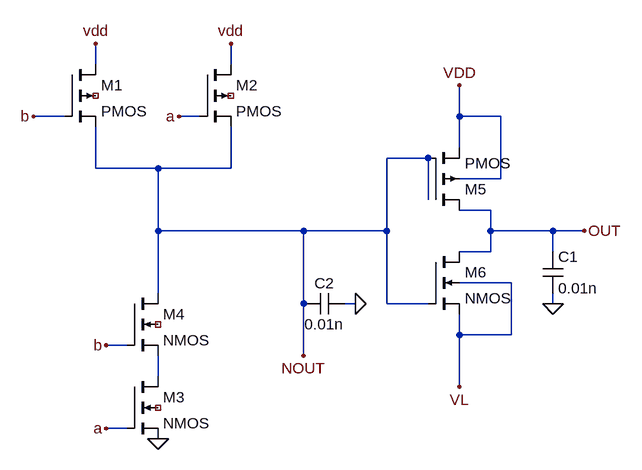
[diagram p0: schematic AND_GATE1.asc]
AND_GATE1.asc, the LTspice schematic file:
Version 4
SHEET 1 880 680
WIRE 16 -128 16 -160
WIRE 224 -128 224 -160
WIRE -32 -48 -80 -48
WIRE 176 -48 144 -48
WIRE 576 -48 576 -96
WIRE 640 -48 576 -48
WIRE 576 0 576 -48
WIRE 528 16 464 16
WIRE 16 32 16 -32
WIRE 112 32 16 32
WIRE 224 32 224 -32
WIRE 224 32 112 32
WIRE 640 48 640 -48
WIRE 640 48 576 48
WIRE 528 80 528 16
WIRE 624 96 576 96
WIRE 112 128 112 32
WIRE 336 128 112 128
WIRE 464 128 464 16
WIRE 464 128 336 128
WIRE 624 128 624 96
WIRE 720 128 624 128
WIRE 768 128 720 128
WIRE 624 160 624 128
WIRE 624 160 576 160
WIRE 720 160 720 128
WIRE 656 208 576 208
WIRE 112 224 112 128
WIRE 336 240 336 128
WIRE 416 240 400 240
WIRE 464 240 464 128
WIRE 528 240 464 240
WIRE 720 240 720 224
WIRE 576 288 576 256
WIRE 656 288 656 208
WIRE 656 288 576 288
WIRE 64 304 32 304
WIRE 336 320 336 240
WIRE 112 352 112 320
WIRE 576 368 576 288
WIRE 64 432 32 432
FLAG 16 -160 vdd
FLAG -80 -48 b
FLAG 144 -48 a
FLAG 32 304 b
FLAG 32 432 a
FLAG 112 448 0
FLAG 224 -160 vdd
FLAG 768 128 OUT
FLAG 576 -96 VDD
FLAG 720 240 0
FLAG 416 240 0
FLAG 336 320 NOUT
FLAG 576 368 VL
SYMBOL pmos4 -32 -128 R0
SYMATTR InstName M1
SYMBOL pmos4 176 -128 R0
SYMATTR InstName M2
SYMBOL nmos4 64 352 R0
SYMATTR InstName M3
SYMBOL nmos4 64 224 R0
SYMATTR InstName M4
SYMBOL pmos4 528 96 M180
SYMATTR InstName M5
SYMBOL nmos4 528 160 R0
SYMATTR InstName M6
SYMBOL cap 704 160 R0
SYMATTR InstName C1
SYMATTR Value 0.01n
SYMBOL cap 336 256 R270
WINDOW 0 32 32 VTop 2
WINDOW 3 0 32 VBottom 2
SYMATTR InstName C2
SYMATTR Value 0.01n

The netlist it stands for:
* AND_GATE1.asc
M1 vdd b NOUT NC_01 PMOS
M2 vdd a NOUT NC_02 PMOS
M3 N001 a 0 NC_03 NMOS
M4 NOUT b N001 NC_04 NMOS
M5 OUT NOUT vdd vdd PMOS
M6 OUT NOUT VL VL NMOS
C1 OUT 0 0.01n
C2 NOUT 0 0.01n
.model NMOS NMOS
.model PMOS PMOS
.lib standard.mos
.backanno
.end